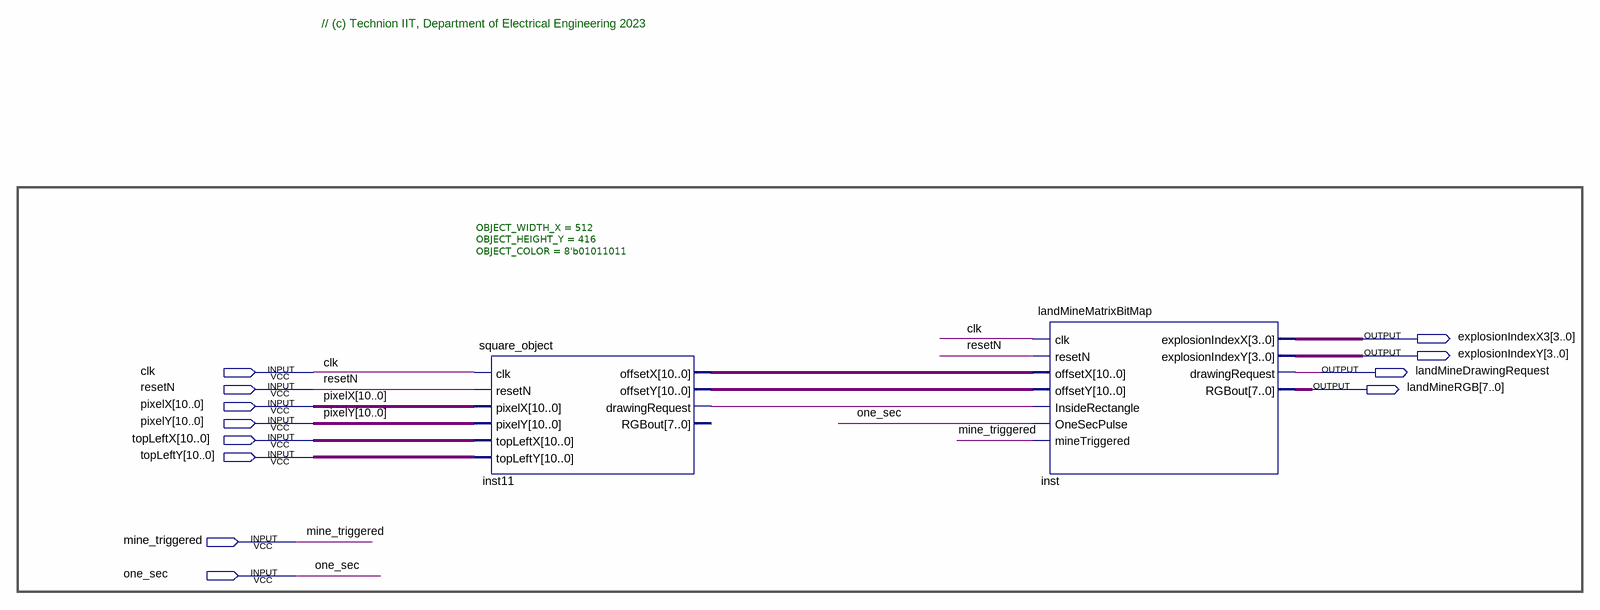
[diagram p0: schematic sheet]
// Quartus schematic land_mine_DISPLAY.bdf as structural Verilog: 2 symbols, 12 pins
module land_mine_DISPLAY (
  input  clk,
  input  resetN,
  input  [10:0] pixelX,
  input  [10:0] pixelY,
  input  [10:0] topLeftX,
  input  [10:0] topLeftY,
  input  mine_triggered,
  input  one_sec,
  output [3:0] explosionIndexX3,
  output [3:0] explosionIndexY,
  output landMineDrawingRequest,
  output [7:0] landMineRGB
);

  wire inst11_drawingrequest;
  wire [10:0] inst11_offsetx, inst11_offsety;

  square_object #(.OBJECT_WIDTH_X(512), .OBJECT_HEIGHT_Y(416), .OBJECT_COLOR(8'b01011011)) inst11 (
    .clk(clk), .resetN(resetN), .pixelX(pixelX), .pixelY(pixelY), .topLeftX(topLeftX), .topLeftY(topLeftY),
    .offsetX(inst11_offsetx), .offsetY(inst11_offsety), .drawingRequest(inst11_drawingrequest));  // open: RGBout
  landMineMatrixBitMap inst (
    .clk(clk), .resetN(resetN), .offsetX(inst11_offsetx), .offsetY(inst11_offsety),
    .InsideRectangle(inst11_drawingrequest), .OneSecPulse(one_sec), .mineTriggered(mine_triggered),
    .explosionIndexX(explosionIndexX3), .explosionIndexY(explosionIndexY),
    .drawingRequest(landMineDrawingRequest), .RGBout(landMineRGB));

  // Notes on the sheet:
  //   // (c) Technion IIT, Department of Electrical Engineering 2023
endmodule
